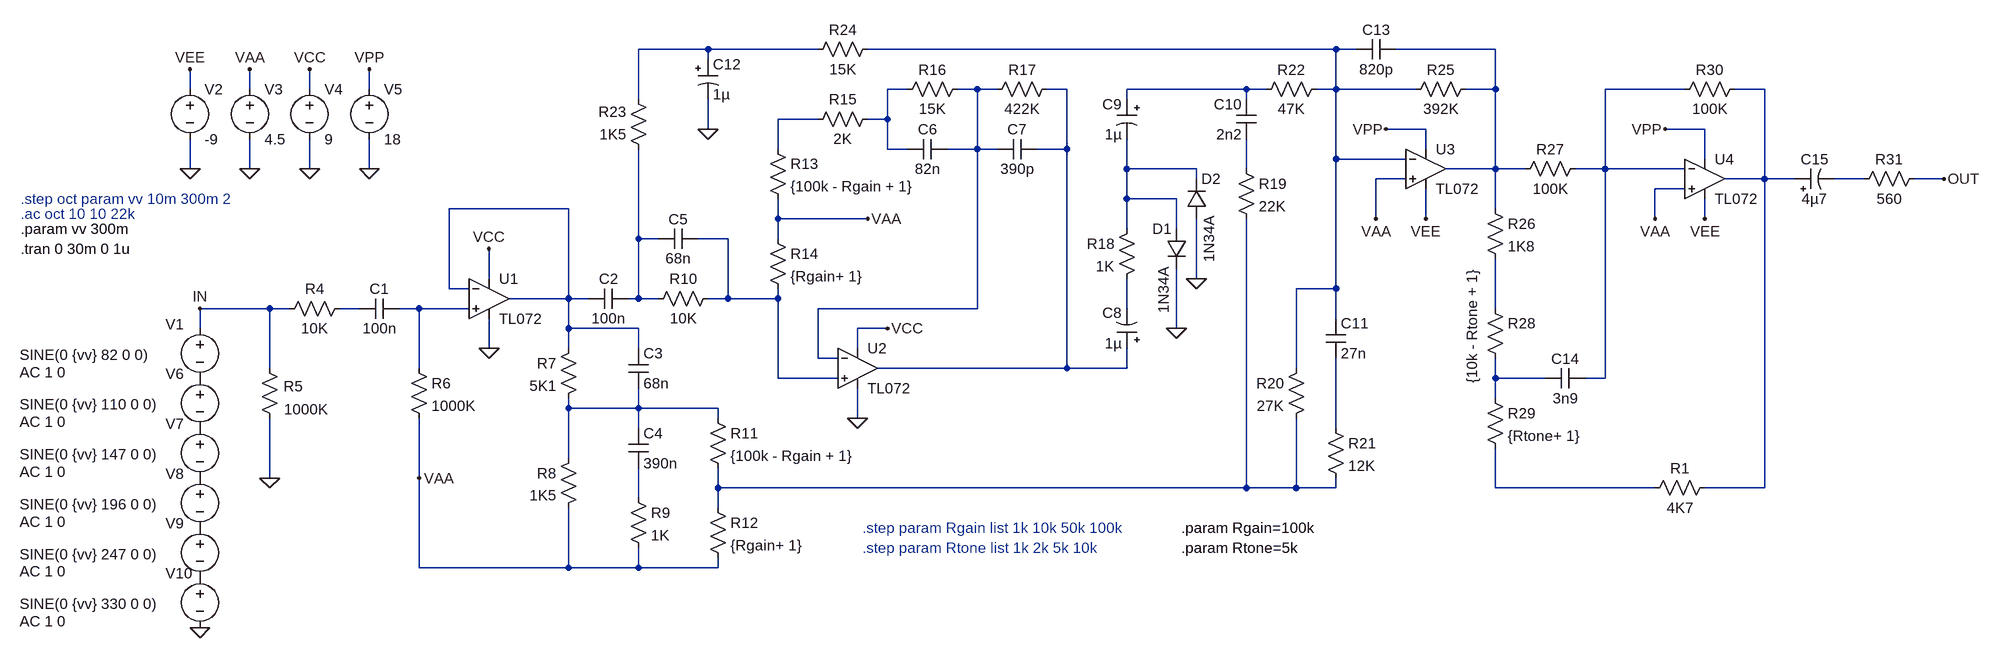
[diagram p0: schematic ltspice-Klon-Centaur.asc]
ltspice-Klon-Centaur.asc, the LTspice schematic file:
Version 4
SHEET 1 3852 5064
WIRE 272 2160 160 2160
WIRE 448 2160 272 2160
WIRE 1280 2160 528 2160
WIRE 1312 2160 1280 2160
WIRE 1536 2160 1376 2160
WIRE 272 2176 272 2160
WIRE -560 2224 -560 2192
WIRE -464 2224 -464 2192
WIRE -368 2224 -368 2192
WIRE -272 2224 -272 2192
WIRE 592 2224 560 2224
WIRE 704 2224 672 2224
WIRE 736 2224 704 2224
WIRE 848 2224 816 2224
WIRE 1136 2224 944 2224
WIRE 1168 2224 1136 2224
WIRE 1280 2224 1280 2160
WIRE 1280 2224 1248 2224
WIRE 1408 2224 1280 2224
WIRE 1536 2224 1536 2160
WIRE 1536 2224 1488 2224
WIRE 1840 2224 1712 2224
WIRE 1968 2224 1920 2224
WIRE 160 2240 160 2160
WIRE 944 2240 944 2224
WIRE 1136 2240 1136 2224
WIRE 448 2272 384 2272
WIRE 560 2272 560 2224
WIRE 560 2272 528 2272
WIRE 272 2288 272 2240
WIRE 1424 2288 1360 2288
WIRE 1872 2288 1808 2288
WIRE 384 2320 384 2272
WIRE 560 2320 560 2272
WIRE 592 2320 560 2320
WIRE 704 2320 704 2224
WIRE 704 2320 656 2320
WIRE 736 2320 704 2320
WIRE 848 2320 848 2224
WIRE 848 2320 800 2320
WIRE 1424 2320 1424 2288
WIRE 1280 2336 1280 2224
WIRE 1392 2336 1280 2336
WIRE 1872 2336 1872 2288
WIRE -560 2352 -560 2304
WIRE -464 2352 -464 2304
WIRE -368 2352 -368 2304
WIRE -272 2352 -272 2304
WIRE 944 2352 944 2304
WIRE 1056 2352 944 2352
WIRE 1136 2352 1136 2304
WIRE 1536 2352 1536 2224
WIRE 1536 2352 1456 2352
WIRE 1584 2352 1536 2352
WIRE 1712 2352 1712 2224
WIRE 1712 2352 1664 2352
WIRE 1840 2352 1712 2352
WIRE 1056 2368 1056 2352
WIRE 1392 2368 1344 2368
WIRE 1968 2368 1968 2224
WIRE 1968 2368 1904 2368
WIRE 2016 2368 1968 2368
WIRE 2128 2368 2080 2368
WIRE 2256 2368 2208 2368
WIRE 1840 2384 1792 2384
WIRE 944 2400 944 2352
WIRE 1024 2400 944 2400
WIRE 48 2416 -144 2416
WIRE 1536 2416 1536 2352
WIRE 384 2432 384 2400
WIRE 528 2432 384 2432
WIRE 1344 2432 1344 2368
WIRE 1424 2432 1424 2384
WIRE 1792 2432 1792 2384
WIRE 1872 2432 1872 2400
WIRE 944 2448 944 2400
WIRE 1024 2448 1024 2400
WIRE 160 2464 160 2320
WIRE 192 2464 160 2464
WIRE 304 2464 256 2464
WIRE 384 2464 384 2432
WIRE -80 2528 -80 2480
WIRE 1056 2528 1056 2432
WIRE -144 2544 -144 2416
WIRE -112 2544 -144 2544
WIRE 1280 2544 1280 2336
WIRE 1280 2544 1216 2544
WIRE 48 2560 48 2416
WIRE 48 2560 -48 2560
WIRE 80 2560 48 2560
WIRE 160 2560 160 2464
WIRE 160 2560 144 2560
WIRE 192 2560 160 2560
WIRE 304 2560 304 2464
WIRE 304 2560 272 2560
WIRE 384 2560 384 2544
WIRE 384 2560 304 2560
WIRE -432 2576 -544 2576
WIRE -400 2576 -432 2576
WIRE -288 2576 -320 2576
WIRE -192 2576 -224 2576
WIRE -112 2576 -192 2576
WIRE 704 2576 704 2320
WIRE 704 2576 448 2576
WIRE 944 2576 944 2528
WIRE 1536 2576 1536 2496
WIRE 1280 2592 1280 2544
WIRE -544 2608 -544 2576
WIRE 48 2608 48 2560
WIRE 160 2608 48 2608
WIRE 560 2608 512 2608
WIRE 1024 2608 1024 2512
WIRE -80 2640 -80 2592
WIRE 48 2640 48 2608
WIRE 160 2640 160 2608
WIRE 512 2640 512 2608
WIRE 448 2656 448 2576
WIRE 480 2656 448 2656
WIRE -432 2672 -432 2576
WIRE -192 2672 -192 2576
WIRE 848 2672 848 2320
WIRE 848 2672 544 2672
WIRE 944 2672 944 2640
WIRE 944 2672 848 2672
WIRE 1216 2672 1216 2544
WIRE 384 2688 384 2560
WIRE 480 2688 384 2688
WIRE 1536 2688 1536 2656
WIRE 1616 2688 1536 2688
WIRE 1712 2688 1712 2352
WIRE 1712 2688 1680 2688
WIRE 1536 2720 1536 2688
WIRE 48 2736 48 2720
WIRE 160 2736 160 2704
WIRE 160 2736 48 2736
WIRE 288 2736 160 2736
WIRE 288 2752 288 2736
WIRE 512 2752 512 2704
WIRE 160 2768 160 2736
WIRE 1280 2768 1280 2656
WIRE 48 2816 48 2736
WIRE -432 2848 -432 2752
WIRE -192 2848 -192 2752
WIRE 288 2864 288 2832
WIRE 1136 2864 1136 2432
WIRE 1136 2864 288 2864
WIRE 1216 2864 1216 2752
WIRE 1216 2864 1136 2864
WIRE 1280 2864 1280 2848
WIRE 1280 2864 1216 2864
WIRE 1536 2864 1536 2800
WIRE 1792 2864 1536 2864
WIRE 1968 2864 1968 2368
WIRE 1968 2864 1872 2864
WIRE 160 2880 160 2832
WIRE 288 2896 288 2864
WIRE -192 2992 -192 2848
WIRE 48 2992 48 2896
WIRE 48 2992 -192 2992
WIRE 160 2992 160 2960
WIRE 160 2992 48 2992
WIRE 288 2992 288 2976
WIRE 288 2992 160 2992
FLAG -432 2848 0
FLAG -192 2848 VAA
FLAG -544 2576 IN
FLAG -80 2640 0
FLAG -80 2480 VCC
FLAG 528 2432 VAA
FLAG 512 2752 0
FLAG 560 2608 VCC
FLAG 1024 2608 0
FLAG 1056 2528 0
FLAG 272 2288 0
FLAG 1424 2432 VEE
FLAG 1360 2288 VPP
FLAG 1344 2432 VAA
FLAG 1792 2432 VAA
FLAG 1808 2288 VPP
FLAG 1872 2432 VEE
FLAG 2256 2368 OUT
FLAG -560 2352 0
FLAG -464 2352 0
FLAG -368 2352 0
FLAG -272 2352 0
FLAG -560 2192 VEE
FLAG -464 2192 VAA
FLAG -368 2192 VCC
FLAG -272 2192 VPP
FLAG -544 3088 0
SYMBOL voltage -544 2592 R0
WINDOW 0 -55 9 Left 2
WINDOW 123 -289 86 Left 2
WINDOW 39 0 0 Left 0
WINDOW 3 -289 58 Left 2
SYMATTR InstName V1
SYMATTR Value2 AC 1 0
SYMATTR Value SINE(0 {vv} 82 0 0)
SYMBOL res -304 2560 R90
WINDOW 0 0 56 VBottom 2
WINDOW 3 32 56 VTop 2
SYMATTR InstName R4
SYMATTR Value 10K
SYMBOL res -416 2768 R180
WINDOW 0 -37 67 Left 2
WINDOW 3 -77 30 Left 2
SYMATTR InstName R5
SYMATTR Value 1000K
SYMBOL cap -224 2560 R90
WINDOW 0 0 32 VBottom 2
WINDOW 3 32 32 VTop 2
SYMATTR InstName C1
SYMATTR Value 100n
SYMBOL res -208 2656 R0
SYMATTR InstName R6
SYMATTR Value 1000K
SYMBOL OpAmps\\TL072 -80 2496 R0
SYMATTR InstName U1
SYMBOL res 64 2624 M0
SYMATTR InstName R7
SYMATTR Value 5K1
SYMBOL res 64 2800 M0
SYMATTR InstName R8
SYMATTR Value 1K5
SYMBOL cap 144 2544 R90
WINDOW 0 0 32 VBottom 2
WINDOW 3 32 32 VTop 2
SYMATTR InstName C2
SYMATTR Value 100n
SYMBOL cap 144 2640 R0
SYMATTR InstName C3
SYMATTR Value 68n
SYMBOL cap 144 2768 R0
SYMATTR InstName C4
SYMATTR Value 390n
SYMBOL res 144 2864 R0
SYMATTR InstName R9
SYMATTR Value 1K
SYMBOL res 288 2544 R90
WINDOW 0 0 56 VBottom 2
WINDOW 3 32 56 VTop 2
SYMATTR InstName R10
SYMATTR Value 10K
SYMBOL cap 256 2448 R90
WINDOW 0 0 32 VBottom 2
WINDOW 3 32 32 VTop 2
SYMATTR InstName C5
SYMATTR Value 68n
SYMBOL res 272 2736 R0
SYMATTR InstName R11
SYMATTR Value {100k - Rgain + 1}
SYMBOL res 272 2880 R0
SYMATTR InstName R12
SYMATTR Value {Rgain+ 1}
SYMBOL res 368 2304 R0
SYMATTR InstName R13
SYMATTR Value {100k - Rgain + 1}
SYMBOL res 368 2448 R0
SYMATTR InstName R14
SYMATTR Value {Rgain+ 1}
SYMBOL OpAmps\\TL072 512 2608 R0
SYMATTR InstName U2
SYMBOL res 544 2256 R90
WINDOW 0 0 56 VBottom 2
WINDOW 3 32 56 VTop 2
SYMATTR InstName R15
SYMATTR Value 2K
SYMBOL res 688 2208 R90
WINDOW 0 0 56 VBottom 2
WINDOW 3 32 56 VTop 2
SYMATTR InstName R16
SYMATTR Value 15K
SYMBOL cap 656 2304 R90
WINDOW 0 0 32 VBottom 2
WINDOW 3 32 32 VTop 2
SYMATTR InstName C6
SYMATTR Value 82n
SYMBOL cap 800 2304 R90
WINDOW 0 0 32 VBottom 2
WINDOW 3 32 32 VTop 2
SYMATTR InstName C7
SYMATTR Value 390p
SYMBOL res 832 2208 R90
WINDOW 0 0 56 VBottom 2
WINDOW 3 32 56 VTop 2
SYMATTR InstName R17
SYMATTR Value 422K
SYMBOL polcap 960 2640 R180
WINDOW 0 24 57 Left 2
WINDOW 3 24 8 Left 2
SYMATTR InstName C8
SYMATTR Value 1µ
SYMATTR Description Capacitor
SYMATTR Type cap
SYMATTR SpiceLine V=50 Irms=36m Rser=3.5 Lser=0 mfg="Nichicon" pn="UPL1H010MAH" type="Al electrolytic"
SYMBOL polcap 960 2240 M0
SYMATTR InstName C9
SYMATTR Value 1µ
SYMATTR Description Capacitor
SYMATTR Type cap
SYMATTR SpiceLine V=50 Irms=36m Rser=3.5 Lser=0 mfg="Nichicon" pn="UPL1H010MAH" type="Al electrolytic"
SYMBOL res 960 2432 M0
SYMATTR InstName R18
SYMATTR Value 1K
SYMBOL diode 1040 2448 M0
WINDOW 3 37 136 VLeft 2
SYMATTR Value 1N34A
SYMATTR InstName D1
SYMBOL diode 1040 2432 M180
WINDOW 0 24 64 Left 2
WINDOW 3 36 3 VLeft 2
SYMATTR InstName D2
SYMATTR Value 1N34A
SYMBOL cap 1152 2240 M0
SYMATTR InstName C10
SYMATTR Value 2n2
SYMBOL res 1120 2336 R0
SYMATTR InstName R19
SYMATTR Value 22K
SYMBOL res 1232 2656 M0
SYMATTR InstName R20
SYMATTR Value 27K
SYMBOL res 1264 2752 R0
SYMATTR InstName R21
SYMATTR Value 12K
SYMBOL cap 1264 2592 R0
SYMATTR InstName C11
SYMATTR Value 27n
SYMBOL res 1264 2208 R90
WINDOW 0 0 56 VBottom 2
WINDOW 3 32 56 VTop 2
SYMATTR InstName R22
SYMATTR Value 47K
SYMBOL res 176 2336 R180
WINDOW 0 36 76 Left 2
WINDOW 3 36 40 Left 2
SYMATTR InstName R23
SYMATTR Value 1K5
SYMBOL polcap 256 2176 R0
WINDOW 3 24 56 Left 2
SYMATTR Value 1µ
SYMATTR InstName C12
SYMATTR Description Capacitor
SYMATTR Type cap
SYMATTR SpiceLine V=16 Irms=0 Rser=11 Lser=0 mfg="AVX" pn="TAJA105K016" type="Tantalum"
SYMBOL res 544 2144 R90
WINDOW 0 0 56 VBottom 2
WINDOW 3 32 56 VTop 2
SYMATTR InstName R24
SYMATTR Value 15K
SYMBOL OpAmps\\TL072 1424 2288 R0
SYMATTR InstName U3
SYMBOL res 1504 2208 R90
WINDOW 0 0 56 VBottom 2
WINDOW 3 32 56 VTop 2
SYMATTR InstName R25
SYMATTR Value 392K
SYMBOL cap 1376 2144 R90
WINDOW 0 0 32 VBottom 2
WINDOW 3 32 32 VTop 2
SYMATTR InstName C13
SYMATTR Value 820p
SYMBOL res 1520 2400 R0
SYMATTR InstName R26
SYMATTR Value 1K8
SYMBOL res 1680 2336 R90
WINDOW 0 0 56 VBottom 2
WINDOW 3 32 56 VTop 2
SYMATTR InstName R27
SYMATTR Value 100K
SYMBOL res 1520 2560 R0
WINDOW 3 -22 -47 VRight 2
SYMATTR Value {10k - Rtone + 1}
SYMATTR InstName R28
SYMBOL res 1520 2704 R0
SYMATTR InstName R29
SYMATTR Value {Rtone+ 1}
SYMBOL cap 1680 2672 R90
WINDOW 0 0 32 VBottom 2
WINDOW 3 32 32 VTop 2
SYMATTR InstName C14
SYMATTR Value 3n9
SYMBOL OpAmps\\TL072 1872 2304 R0
SYMATTR InstName U4
SYMBOL res 1936 2208 R90
WINDOW 0 0 56 VBottom 2
WINDOW 3 32 56 VTop 2
SYMATTR InstName R30
SYMATTR Value 100K
SYMBOL polcap 2016 2384 R270
WINDOW 0 32 32 VTop 2
WINDOW 3 0 32 VBottom 2
SYMATTR InstName C15
SYMATTR Value 4µ7
SYMATTR Description Capacitor
SYMATTR Type cap
SYMATTR SpiceLine V=50 Irms=36m Rser=3.5 Lser=0
SYMBOL res 2224 2352 R90
WINDOW 0 0 56 VBottom 2
WINDOW 3 32 56 VTop 2
SYMATTR InstName R31
SYMATTR Value 560
SYMBOL voltage -560 2208 R0
WINDOW 123 0 0 Left 0
WINDOW 39 0 0 Left 0
SYMATTR InstName V2
SYMATTR Value -9
SYMBOL voltage -464 2208 R0
WINDOW 123 0 0 Left 0
WINDOW 39 0 0 Left 0
SYMATTR InstName V3
SYMATTR Value 4.5
SYMBOL voltage -368 2208 R0
WINDOW 123 0 0 Left 0
WINDOW 39 0 0 Left 0
SYMATTR InstName V4
SYMATTR Value 9
SYMBOL voltage -272 2208 R0
WINDOW 123 0 0 Left 0
WINDOW 39 0 0 Left 0
SYMATTR InstName V5
SYMATTR Value 18
SYMBOL voltage -544 2672 R0
WINDOW 0 -55 9 Left 2
WINDOW 123 -289 86 Left 2
WINDOW 39 0 0 Left 0
WINDOW 3 -289 58 Left 2
SYMATTR InstName V6
SYMATTR Value2 AC 1 0
SYMATTR Value SINE(0 {vv} 110 0 0)
SYMBOL voltage -544 2752 R0
WINDOW 0 -55 9 Left 2
WINDOW 123 -289 86 Left 2
WINDOW 39 0 0 Left 0
WINDOW 3 -289 58 Left 2
SYMATTR InstName V7
SYMATTR Value2 AC 1 0
SYMATTR Value SINE(0 {vv} 147 0 0)
SYMBOL voltage -544 2832 R0
WINDOW 0 -55 9 Left 2
WINDOW 123 -289 86 Left 2
WINDOW 39 0 0 Left 0
WINDOW 3 -289 58 Left 2
SYMATTR InstName V8
SYMATTR Value2 AC 1 0
SYMATTR Value SINE(0 {vv} 196 0 0)
SYMBOL res 1888 2848 R90
WINDOW 0 0 56 VBottom 2
WINDOW 3 32 56 VTop 2
SYMATTR InstName R1
SYMATTR Value 4K7
SYMBOL voltage -544 2912 R0
WINDOW 0 -55 9 Left 2
WINDOW 123 -289 86 Left 2
WINDOW 39 0 0 Left 0
WINDOW 3 -289 58 Left 2
SYMATTR InstName V9
SYMATTR Value2 AC 1 0
SYMATTR Value SINE(0 {vv} 247 0 0)
SYMBOL voltage -544 2992 R0
WINDOW 0 -55 9 Left 2
WINDOW 123 -289 86 Left 2
WINDOW 39 0 0 Left 0
WINDOW 3 -289 58 Left 2
SYMATTR InstName V10
SYMATTR Value2 AC 1 0
SYMATTR Value SINE(0 {vv} 330 0 0)
TEXT -832 2424 Left 2 ;.ac oct 10 10 22k
TEXT 1032 2928 Left 2 !.param Rgain=100k
TEXT 520 2928 Left 2 ;.step param Rgain list 1k 10k 50k 100k
TEXT 1032 2960 Left 2 !.param Rtone=5k
TEXT 520 2960 Left 2 ;.step param Rtone list 1k 2k 5k 10k
TEXT -832 2480 Left 2 !.tran 0 30m 0 1u
TEXT -832 2400 Left 2 ;.step oct param vv 10m 300m 2
TEXT -832 2448 Left 2 !.param vv 300m

The netlist it stands for:
* ltspice-Klon-Centaur.asc
V1 IN P001 SINE(0 {vv} 82 0 0) AC 1 0
R4 N017 IN 10K
R5 0 IN 1000K
C1 N018 N017 100n
R6 N018 VAA 1000K
XU1 N018 N014 VCC 0 N014 TL072  ; pins In+ In- V+ V- OUT
R7 N014 N022 5K1
R8 N022 VAA 1K5
C2 N015 N014 100n
C3 N014 N022 68n
C4 N022 N026 390n
R9 N026 VAA 1K
R10 N016 N015 10K
C5 N016 N015 68n
R11 N022 N024 {100k - Rgain + 1}
R12 N024 VAA {Rgain+ 1}
R13 N010 VAA {100k - Rgain + 1}
R14 VAA N016 {Rgain+ 1}
XU2 N016 N005 VCC 0 N006 TL072  ; pins In+ In- V+ V- OUT
R15 N004 N010 2K
R16 N005 N004 15K
C6 N005 N004 82n
C7 N006 N005 390p
R17 N006 N005 422K
C8 N006 N019 1µ V=50 Irms=36m Rser=3.5 Lser=0 mfg="Nichicon" pn="UPL1H010MAH" type="Al electrolytic"
C9 N007 N011 1µ V=50 Irms=36m Rser=3.5 Lser=0 mfg="Nichicon" pn="UPL1H010MAH" type="Al electrolytic"
R18 N011 N019 1K
D1 N011 0 1N34A
D2 0 N011 1N34A
C10 N007 N012 2n2
R19 N012 N024 22K
R20 N002 N024 27K
R21 N023 N024 12K
C11 N002 N023 27n
R22 N002 N007 47K
R23 N015 N001 1K5
C12 N001 0 1µ V=16 Irms=0 Rser=11 Lser=0 mfg="AVX" pn="TAJA105K016" type="Tantalum"
R24 N002 N001 15K
XU3 VAA N002 VPP VEE N003 TL072  ; pins In+ In- V+ V- OUT
R25 N003 N002 392K
C13 N003 N002 820p
R26 N003 N020 1K8
R27 N008 N003 100K
R28 N020 N021 {10k - Rtone + 1}
R29 N021 N025 {Rtone+ 1}
C14 N008 N021 3n9
XU4 VAA N008 VPP VEE N009 TL072  ; pins In+ In- V+ V- OUT
R30 N009 N008 100K
C15 N009 N013 4µ7 V=50 Irms=36m Rser=3.5 Lser=0
R31 OUT N013 560
V2 VEE 0 -9
V3 VAA 0 4.5
V4 VCC 0 9
V5 VPP 0 18
V6 P001 P002 SINE(0 {vv} 110 0 0) AC 1 0
V7 P002 P003 SINE(0 {vv} 147 0 0) AC 1 0
V8 P003 P004 SINE(0 {vv} 196 0 0) AC 1 0
R1 N009 N025 4K7
V9 P004 P005 SINE(0 {vv} 247 0 0) AC 1 0
V10 P005 0 SINE(0 {vv} 330 0 0) AC 1 0
.model D D
.lib standard.dio
* .ac oct 10 10 22k
.param Rgain=100k
* .step param Rgain list 1k 10k 50k 100k
.param Rtone=5k
* .step param Rtone list 1k 2k 5k 10k
.tran 0 30m 0 1u
* .step oct param vv 10m 300m 2
.param vv 300m
.backanno
.end